# Altium schematic sheet microwaveBoardAntenna.SchDoc: Microwave Antenna for ODMR
size Letter; SheetNumber: 1; SheetTotal: 1
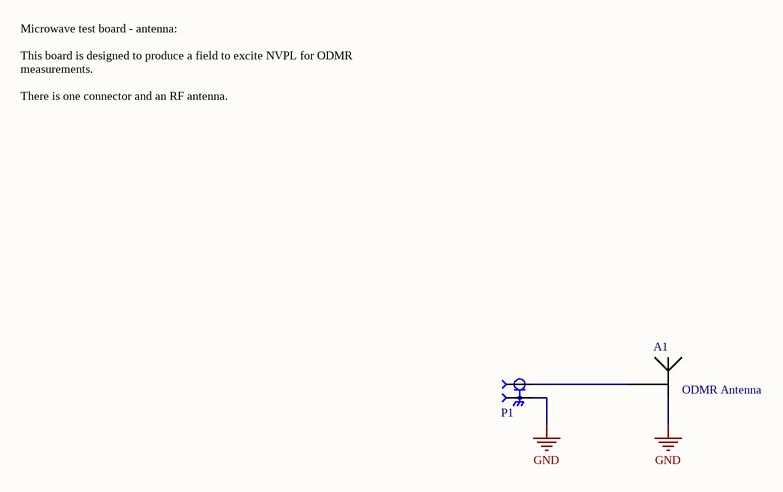
[diagram p0: microwaveBoardAntenna.SchDoc]

## Parts
A1  ODMR Antenna  [ODMR_Antenna]
P1  MMCXV-J-P-HF-ST-EM1  [MMCXV-J-P-HF-ST-EM1]  (value not drawn)

## Nets
GND: A1.2(in) P1.2
NetA1_1: A1.1 P1.1

## Notes on the sheet
- Microwave test board - antenna:
  This board is designed to produce a field to excite NVPL for ODMR measurements.
  There is one connector and an RF antenna.

## Library data of the parts
A1 = Patch Antenna: antenna
P1 = PXX-SAM-00013: 50 OHM MMCX HIGH-VIBRATION JACK,; Index: 13; Designator: P?; Part Number: PXX-SAM-00013; Manufacturer Part Number: MMCXV-J-P-HF-ST-EM1; Supplier Part Number 1: MMCXV-J-P-HF-ST-EM1-ND; Supplier 1: Digi-key; Publisher: AlbertaSat; Published: 10/22/2021; LatestRevisionDate: 10/22/2021; LatestRevisionNote: ...; Supplier Link: #https://www.digikey.ca/en/products/detail/samtec-inc/MMCXV-J-P-HF-ST-EM1/10218387?s=N4IgTCBcDaILJwMIA0BqBaAUugCugEgGLoDKAKugKJwCMIAugL5A#